# Altium schematic sheet Led Lighting.SchDoc
size A4
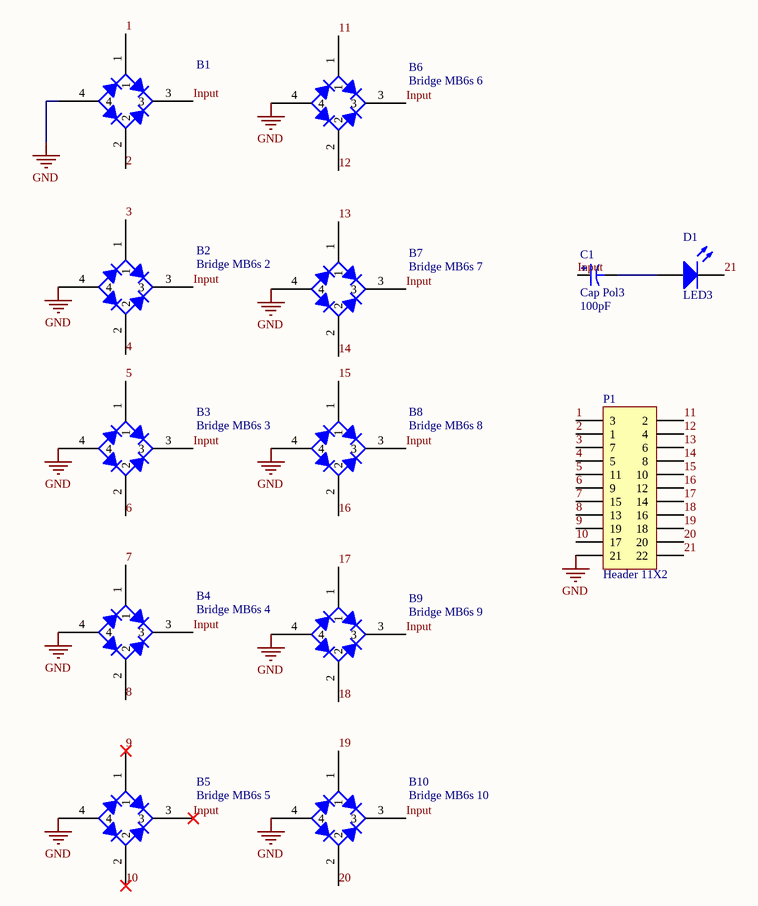
[diagram p0: Led Lighting.SchDoc]

## Parts
B1  (no value)  [MB6S]
B2  Bridge MB6s 2  [MB6S]
B3  Bridge MB6s 3  [MB6S]
B4  Bridge MB6s 4  [MB6S]
B5  Bridge MB6s 5  [MB6S]
B6  Bridge MB6s 6  [MB6S]
B7  Bridge MB6s 7  [MB6S]
B8  Bridge MB6s 8  [MB6S]
B9  Bridge MB6s 9  [MB6S]
B10  Bridge MB6s 10  [MB6S]
C1  Cap Pol3  value 100pF  [C0805]
D1  LED3  [3.5X2.8X1.9]
P1  Header 11X2  [HDR2X11]

## Nets
GND: B1.4 B2.4 B3.4 B4.4 B5.4 B6.4 B7.4 B8.4 B9.4 B10.4 P1.21
1: B1.1 P1.3
2: B1.2 P1.1
3: B2.1 P1.7
4: B2.2 P1.5
5: B3.1 P1.11
6: B3.2 P1.9
7: B4.1 P1.15
8: B4.2 P1.13
9: B5.1 P1.19
10: B5.2 P1.17
11: B6.1 P1.2
12: B6.2 P1.4
13: B7.1 P1.6
14: B7.2 P1.8
15: B8.1 P1.10
16: B8.2 P1.12
17: B9.1 P1.14
18: B9.2 P1.16
19: B10.1 P1.18
20: B10.2 P1.20
21: D1.2(K) P1.22
Input: B1.3 B2.3 B3.3 B4.3 B5.3 B6.3 B7.3 B8.3 B9.3 B10.3 C1.1
NetC1_2: C1.2 D1.1(A)

## Library data of the parts
B1-B10 = Bridge MB6s
C1 = Cap Pol3: Polarized Capacitor (Surface Mount); Published: 8-Jun-2000; LatestRevisionDate: 29-May-2009; LatestRevisionNote: IPC-7351 Footprint Added.; PackageReference: C0805; Publisher: Altium Limited; PackageDescription: Chip Capacitor
D1 = LED3: Typical BLUE SiC LED; Published: 8-Jun-2000; LatestRevisionDate: 17-Dec-2003; LatestRevisionNote: PCB Footprint replaced.; DatasheetVersion: 16-Apr-2002; PackageVersion: 16-Apr-2002; PackageReference: 3.5X2.8X1.9; Publisher: Altium Limited; PackageDescription: SM LED; 2 C-Bend Leads; Body 3.5 x 2.8 x 1.9 mm, inc leads (LxWxH typ)
P1 = Header 11X2: Header, 11-Pin, Dual row; LatestRevisionDate: 17-Jul-2002; LatestRevisionNote: Re-released for DXP Platform.; Publisher: Altium Limited